# Altium schematic sheet LOGICA.SchDoc (part 1 of 2)
size A4; SheetNumber: 2; SheetTotal: 4
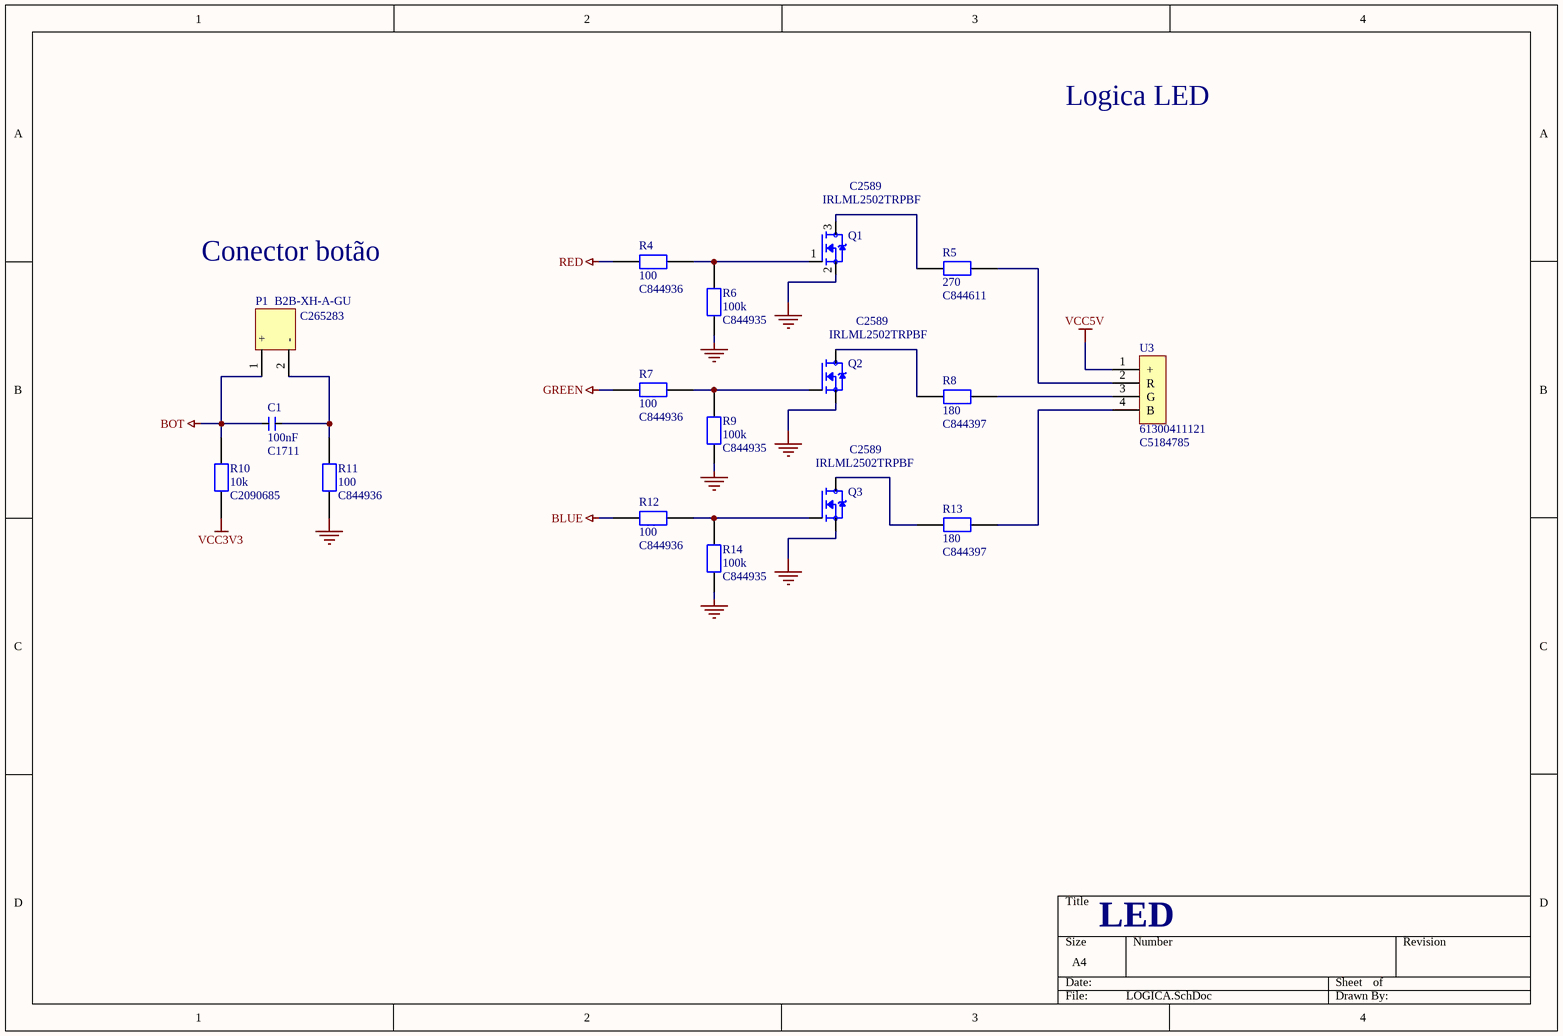
[diagram p0: LOGICA.SchDoc]

## Parts
C1  100nF  LCSC: C1711  [0805_samsung]
P1  B2B-XH-A-GU  LCSC: C265283  [conector2.54mm]
Q1  IRLML2502TRPBF  LCSC: C2589  [mosfet]
Q2  IRLML2502TRPBF  LCSC: C2589  [mosfet]
Q3  IRLML2502TRPBF  LCSC: C2589  [mosfet]
R4  100  LCSC: C844936  [100Resistor]
R5  270  LCSC: C844611  [270Resistor]
R6  100k  LCSC: C844935  [100kResistor]
R7  100  LCSC: C844936  [100Resistor]
R8  180  LCSC: C844397  [180Resistor]
R9  100k  LCSC: C844935  [100kResistor]
R10  10k  LCSC: C2090685  [10kResistor]
R11  100  LCSC: C844936  [100Resistor]
R12  100  LCSC: C844936  [100Resistor]
R13  180  LCSC: C844397  [180Resistor]
R14  100k  LCSC: C844935  [100kResistor]
U3  61300411121  LCSC: C5184785  [conector4pinos]

## Nets
BLUE: R12.1
BOT: C1.1 P1.1(+) R10.2
GND: Q1.2(S) Q2.2(S) Q3.2(S) R6.1 R9.1 R11.2 R14.1
GREEN: R7.1
RED: R4.1
VCC3V3: R10.1
VCC5V: U3.1(+)
NetC1_2: C1.2 P1.2(-) R11.1
NetQ1_1: Q1.1(G) R4.2 R6.2
NetQ1_3: Q1.3(D) R5.1
NetQ2_1: Q2.1(G) R7.2 R9.2
NetQ2_3: Q2.3(D) R8.1
NetQ3_1: Q3.1(G) R12.2 R14.2
NetQ3_3: Q3.3(D) R13.1
NetR5_2: R5.2 U3.2(R)
NetR8_2: R8.2 U3.3(G)
NetR13_2: R13.2 U3.4(B)

## Notes on the sheet
- Logica LED
- Conector botão
- LED